# Altium schematic sheet 4fader_main.SchDoc
size 381 x 203 mm; SheetNumber: 1; SheetTotal: 1
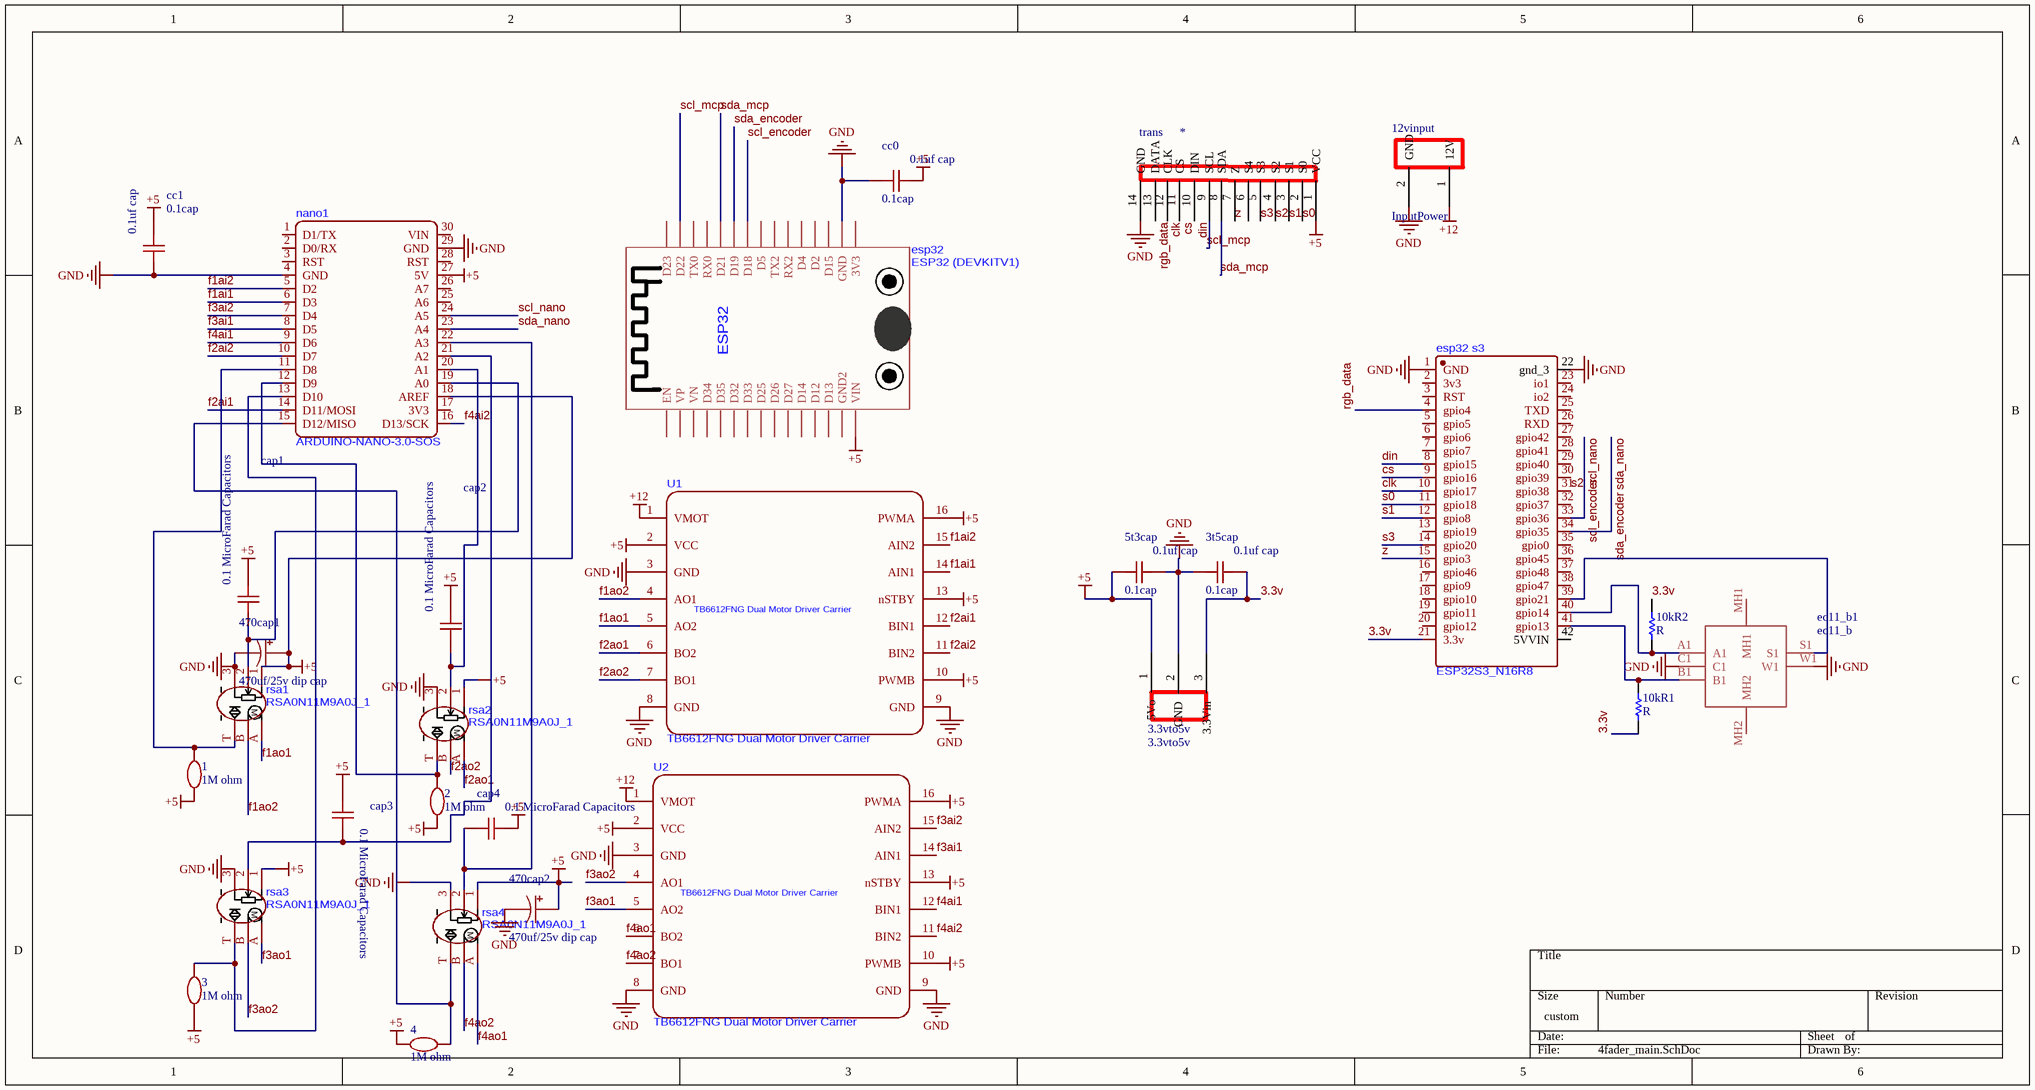
[diagram p0: 4fader_main.SchDoc]

## Parts
1  1M ohm  [ohms]
2  1M ohm  [ohms]
3  1M ohm  [ohms]
3.3vto5v  3.3vto5v  [3.3vto5v]
3t5cap  0.1cap  [capcitor_1nf]
4  1M ohm  [ohms]
5t3cap  0.1cap  [capcitor_1nf]
10kR1  R  [RESC2013X60X30LL20T20]
10kR2  R  [RESC2013X60X30LL20T20]
12vinput  InputPower  [InputPower]
470cap1  470uf/25v dip cap  [470UF/25V-G1]
470cap2  470uf/25v dip cap  [470UF/25V-G1]
*  trans  [FPC-SMD_KH-FG1.0-H2.0-14PIN]
cap1  (no value)  [capcitor_1nf]
cap2  (no value)  [capcitor_1nf]
cap3  (no value)  [capcitor_1nf]
cap4  (no value)  [capcitor_1nf]
cc0  0.1cap  [capcitor_1nf]
cc1  0.1cap  [capcitor_1nf]
ec11_b1  ec11_b  [ec11_b]
esp32  ESP32 (DEVKITV1)  [ESP32-DEVKITV1_ESP32-DEVKITV1]
esp32_s3  ESP32S3_N16R8  [ESP32 S3 N16R8]
nano1  ARDUINO-NANO-3.0-SOS  [arduino_nano]
rsa1  RSA0N11M9A0J_1  [RSA0N11M9A0J]
rsa2  RSA0N11M9A0J_1  [RSA0N11M9A0J]
rsa3  RSA0N11M9A0J_1  [RSA0N11M9A0J]
rsa4  RSA0N11M9A0J_1  [RSA0N11M9A0J]
U1  TB6612FNG Dual Motor Driver Carrier  [TB6612FNG]
U2  TB6612FNG Dual Motor Driver Carrier  [TB6612FNG]

## Nets
+5: 1.1 2.1 3.2 3.3vto5v.1(5Vo) 4.2 5t3cap.1 470cap1.1 470cap2.1 *.1(VCC) cap1.2 cap2.2 cap3.1 cap4.2 cc0.2 cc1.2 esp32.VIN nano1.18(AREF) nano1.27(5V) rsa1.1 rsa2.1 rsa3.1 rsa4.1 U1.2(VCC) U1.10(PWMB) U1.13(nSTBY) U1.16(PWMA) U2.2(VCC) U2.10(PWMB) U2.13(nSTBY) U2.16(PWMA)
+12: 12vinput.1(12V) U1.1(VMOT) U2.1(VMOT)
GND: 3.3vto5v.2(GND) 3t5cap.1 5t3cap.2 12vinput.2(GND) 470cap1.2 470cap2.2 *.14(GND) cc0.1 cc1.1 ec11_b1.C1 ec11_b1.W1 esp32.GND esp32_s3.1(GND) esp32_s3.22(gnd_3) nano1.4(GND) nano1.29(GND) rsa1.3 rsa2.3 rsa3.3 rsa4.3 U1.3(GND) U1.8(GND) U1.9(GND) U2.3(GND) U2.8(GND) U2.9(GND)
3.3v: 3.3vto5v.3(3.3Vin) 3t5cap.2 10kR1.1 10kR2.2 esp32_s3.21(3.3v)
clk: *.12(CLK) esp32_s3.10(gpio17)
cs: *.11(CS) esp32_s3.9(gpio16)
din: *.10(DIN) esp32_s3.8(gpio15)
f1ai1: nano1.6(D3) U1.14(AIN1)
f1ai2: nano1.5(D2) U1.15(AIN2)
f1ao1: rsa1.A U1.5(AO2)
f1ao2: rsa1.B U1.4(AO1)
f2ai1: nano1.14(D11/MOSI) U1.12(BIN1)
f2ai2: nano1.10(D7) U1.11(BIN2)
f2ao1: rsa2.A U1.6(BO2)
f2ao2: rsa2.B U1.7(BO1)
f3ai1: nano1.8(D5) U2.14(AIN1)
f3ai2: nano1.7(D4) U2.15(AIN2)
f3ao1: rsa3.A U2.5(AO2)
f3ao2: rsa3.B U2.4(AO1)
f4ai1: nano1.9(D6) U2.12(BIN1)
f4ai2: nano1.16(D13/SCK) U2.11(BIN2)
f4ao1: rsa4.A U2.6(BO2)
f4ao2: rsa4.B U2.7(BO1)
rgb_data: *.13(DATA) esp32_s3.4(gpio4)
s0: *.2(S0) esp32_s3.11(gpio18)
s1: *.3(S1) esp32_s3.12(gpio8)
s2: *.4(S2) esp32_s3.31(gpio38)
s3: *.5(S3) esp32_s3.14(gpio20)
scl_encoder: esp32.D18 esp32_s3.33(gpio36) nano1.24(A5)  [also labelled scl_nano]
scl_mcp: *.9(SCL) esp32.D22
sda_encoder: esp32.D19 esp32_s3.34(gpio35) nano1.23(A4)  [also labelled sda_nano]
sda_mcp: *.8(SDA) esp32.D21
z: *.7(Z) esp32_s3.15(gpio3)
Net1_2: 1.2 nano1.11(D8) rsa1.T
Net2_2: 2.2 nano1.12(D9) rsa2.T
Net3_1: 3.1 nano1.13(D10) rsa3.T
Net4_1: 4.1 nano1.15(D12/MISO) rsa4.T
Net10kR1_2: 10kR1.2 ec11_b1.B1 esp32_s3.41(gpio13)
Net10kR2_1: 10kR2.1 ec11_b1.A1 esp32_s3.40(gpio14)
Netcap1_1: cap1.1 nano1.19(A0) rsa1.2(w)
Netcap2_1: cap2.1 nano1.20(A1) rsa2.2(w)
Netcap3_2: cap3.2 nano1.21(A2) rsa3.2(w)
Netcap4_1: cap4.1 nano1.22(A3) rsa4.2(w)
Netec11_b1_S1: ec11_b1.S1 esp32_s3.39(gpio21)

Not connected (* = marked no-connect by the designer): * 6(S4); ec11_b1 MH1 MH2; esp32 3V3 D2 D4 D5 D12 D13 D14 D15 D23 D25 D26 D27 D32 D33 D34 D35 EN GND2 RX0 RX2 TX0 TX2 VN VP; esp32_s3 2(3v3) 3(RST) 5(gpio5) 6(gpio6) 7(gpio7) 13(gpio19) 16(gpio46) 17(gpio9) 18(gpio10) 19(gpio11) 20(gpio12) 23(io1) 24(io2) 25(TXD) 26(RXD) 27(gpio42) 28(gpio41) 29(gpio40) 30(gpio39) 32(gpio37) 35(gpio0) 36(gpio45) 37(gpio48) 38(gpio47) 42(5VVIN); nano1 1(D1/TX) 2(D0/RX) 3(RST) 17(3V3) 25(A6) 26(A7) 28(RST) 30(VIN)

## Notes on the sheet
- (in symbol 0.1cap) 0.1 MicroFarad Capacitors; 0.1uf cap
- (in symbol ESP32 (DEVKITV1)) ESP32
- (in symbol RSA0N11M9A0J_1) M

## Library data of the parts
1-4 = 33k ohm
10kR1 10kR2 = CMP-2001-02660-1: Manufacturer: KOA Speer; Part Number: SG73S2ATTD1101F
cap1-cap4 = 0.1cap
ec11_b1 = ec11_b: pin to pad: A1>A B1>B C1>C MH1>none MH2>none S1>D W1>E